# EAGLE design gsm_module (EAGLE 6.5.0)
PARTNAME: gsm_module; REVISION: 3.0
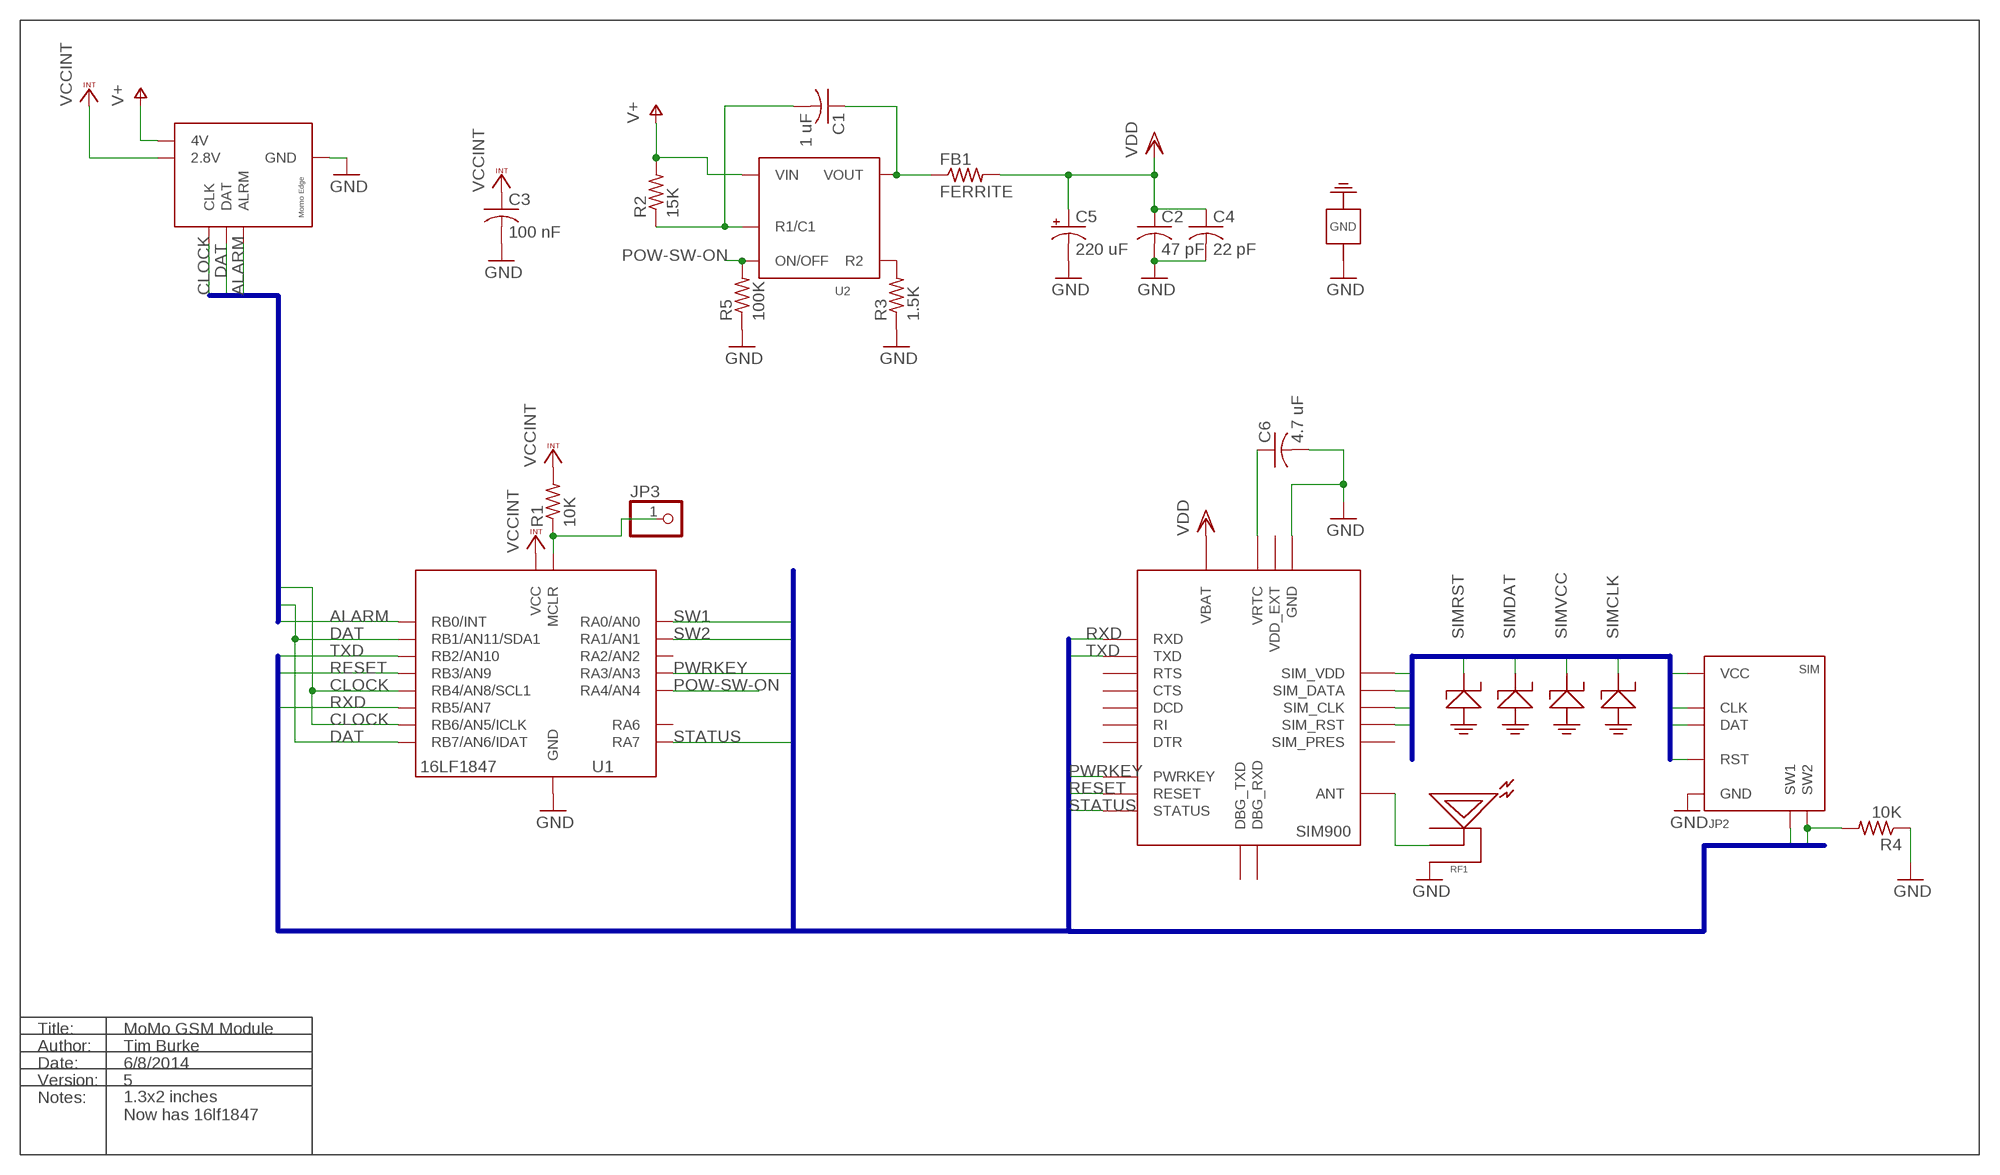
[diagram p0: schematic, sheet 1]

## Parts
C1  1 uF  C-USC0402K  [C0402K]
C2  47 pF  C-USC0402K  [C0402K]
C3  100 nF  C-USC0402  [C0402]
C4  22 pF  C-USC0402K  [C0402K]
C5  220 uF  CPOL-USCT3528  [CT3528]
C6  4.7 uF  C-USC0805  [C0805]
FB1  FERRITE  R-US_R0805  [R0805]
JP1  MOMO-EDGE-6M  [MOMO-EDGE-6M]
JP2  SIMHOLDER-8PINMICROSIM  [MOLEX-MICROSIM-0787270001]
JP3  PINHD-1X1  [1X01]
R1  10K  R-US_R0603  [R0603]
R2  15K  R-US_R0603  [R0603]
R3  1.5K  R-US_R0603  [R0603]
R4  10K  R-US_R0603  [R0603]
R5  100K  R-US_R0603  [R0603]
RF1  RFANTENNA  [RFJACK]
U1  PIC16LF1847  [SSOP20]
U2  TI-HIGHSIDE-PFET  [SOT23-6L]
U3  SIM900  [SIM900]
U4  ESD-SMF05C  [SC70-6L]

## Nets
ALARM: JP1.ALARM(ALRM) U1.7(RB0/INT)
CLOCK: JP1.CLK U1.11(RB4/AN8/SCL1) U1.13(RB6/AN5/ICLK)
DAT: JP1.DAT U1.8(RB1/AN11/SDA1) U1.14(RB7/AN6/IDAT)
GND: C2.2 C3.2 C4.2 C5.- C6.2 JP1.GND JP2.C5(GND) JP2.GND1(GND) JP2.GND2(GND) JP2.GND3(GND) JP2.GND4(GND) JP2.GND5(GND) JP2.GND6(GND) R3.1 R4.1 R5.1 RF1.UNUSED1(SHIELD) RF1.UNUSED2(SHIELD) U1.5(GND) U1.6(GND) U3.17(GND) U3.18(GND) U3.29(GND) U3.39(GND) U3.45(GND) U3.46(GND) U3.53(GND) U3.54(GND) U3.58(GND) U3.59(GND) U3.61(GND) U3.62(GND) U3.63(GND) U3.64(GND) U3.65(GND) U4.2
N$1: R3.2 U2.1(R2)
N$2: JP3.1 R1.1 U1.4(MCLR)
N$3: C1.2 R2.1 U2.6(R1/C1)
N$4: C1.1 FB1.1 U2.2(VOUT) U2.3(VOUT)
N$5: C6.1 U3.26(VRTC)
N$7: RF1.ANTENNA(PIN) U3.60(ANT)
POW-SW-ON: R5.2 U1.3(RA4/AN4) U2.5(ON/OFF)
PWRKEY: U1.2(RA3/AN3) U3.1(PWRKEY)
RESET: U1.10(RB3/AN9) U3.16(RESET)
RXD: U1.12(RB5/AN7) U3.10(RXD)
SIMCLK: JP2.C3(CLK) U3.32(SIM_CLK) U4.3
SIMDAT: JP2.C7(DAT) U3.31(SIM_DATA) U4.5
SIMRST: JP2.C2(RST) U3.33(SIM_RST) U4.1
SIMVCC: JP2.C1(VCC) U3.30(SIM_VDD) U4.4
STATUS: U1.18(RA7) U3.66(STATUS)
SW1: JP2.DCONT(SW1) U1.19(RA0/AN0)
SW2: JP2.DSPRING(SW2) R4.2 U1.20(RA1/AN1)
TXD: U1.9(RB2/AN10) U3.9(TXD)
V+: JP1.4V R2.2 U2.4(VIN)
VCCINT: C3.1 JP1.V28(2.8V) R1.2 U1.15(VCC) U1.16(VCC)
VDD: C2.1 C4.1 C5.+ FB1.2 U3.55(VBAT) U3.56(VBAT) U3.57(VBAT)
Unconnected: U1.1(RA2/AN2) U1.17(RA6) U3.3(DTR) U3.4(RI) U3.5(DCD) U3.7(CTS) U3.8(RTS) U3.27(DBG_TXD) U3.28(DBG_RXD) U3.34(SIM_PRES) U4.6

## Buses
MIB:CLOCK,DAT,PMCLR,ALARM
SIMBUS:SIMVCC,SIMCLK,SIMDAT,SIMRST
SIM900CONN:RXD,TXD,PWRKEY,RESET,STATUS,SW1,SW2

## Notes on the sheet
- Title: | MoMo GSM Module
- Author: | Tim Burke
- Date: | 6/8/2014
- Version: | 5
- Notes:
- 1.3x2 inches
  Now has 16lf1847

## Power pins joined to a net without a drawn wire
VDD_EXT: U3.15(VDD_EXT)

## Library data of the parts
C1 = rcl:C-US: CAPACITOR, American symbol; DIGIKEY-PN: 445-4114-1-ND
C2 = rcl:C-US: CAPACITOR, American symbol; DIGIKEY-PN: 445-1243-1-ND
C3 = rcl:C-US: CAPACITOR, American symbol; DIGIKEY-PN: 445-1265-1-ND
C4 = rcl:C-US: CAPACITOR, American symbol; DIGIKEY-PN: 445-1239-1-ND
C5 = rcl:CPOL-US: POLARIZED CAPACITOR, American symbol
C6 = rcl:C-US: CAPACITOR, American symbol; DIGIKEY-PN: 1276-1259-1-ND
FB1 = rcl:R-US_: RESISTOR, American symbol; DIGIKEY-PN: 445-1567-1-ND
JP1 = components:MOMO-EDGE-6M; DESCRIPTION: 6 pin r/a male header; DIGIKEY-PN: 609-3327-ND; FOOTPRINT: Through Hole
JP2 = components:SIMHOLDER-8PIN; DIGIKEY-PN: WM9260CT-ND
JP3 = pinhead:PINHD-1X1: PIN HEADER
R1 R4 = rcl:R-US_: RESISTOR, American symbol; DIGIKEY-PN: P10.0KHCT-ND
R2 = rcl:R-US_: RESISTOR, American symbol; DIGIKEY-PN: P15KGCT-ND
R3 = rcl:R-US_: RESISTOR, American symbol; DIGIKEY-PN: P1.5KGCT-ND
R5 = rcl:R-US_: RESISTOR, American symbol; DIGIKEY-PN: P100KHCT-ND
RF1 = components:RFANTENNA; DIGIKEY-PN: J983CT-ND
U1 = components:PIC16LF1847; DIGIKEY-PN: PIC16LF1847-I/SS-ND
U2 = components:TI-HIGHSIDE-PFET; DESCRIPTION: TPS27081 Highside Load Controller; DIGIKEY-PN: 296-34970-1-ND
U3 = components:SIM900; DESCRIPTION: SIM900 GSM/GPRS Quadband GSM Modem; FOOTPRINT: Custom SMD; MANU: SIMCOM; MPN: SIM900
U4 = components:ESD-SMF05C; DESCRIPTION: Fast ESD Diode (Quadpack); DIGIKEY-PN: SMF05CCT-ND

## Board
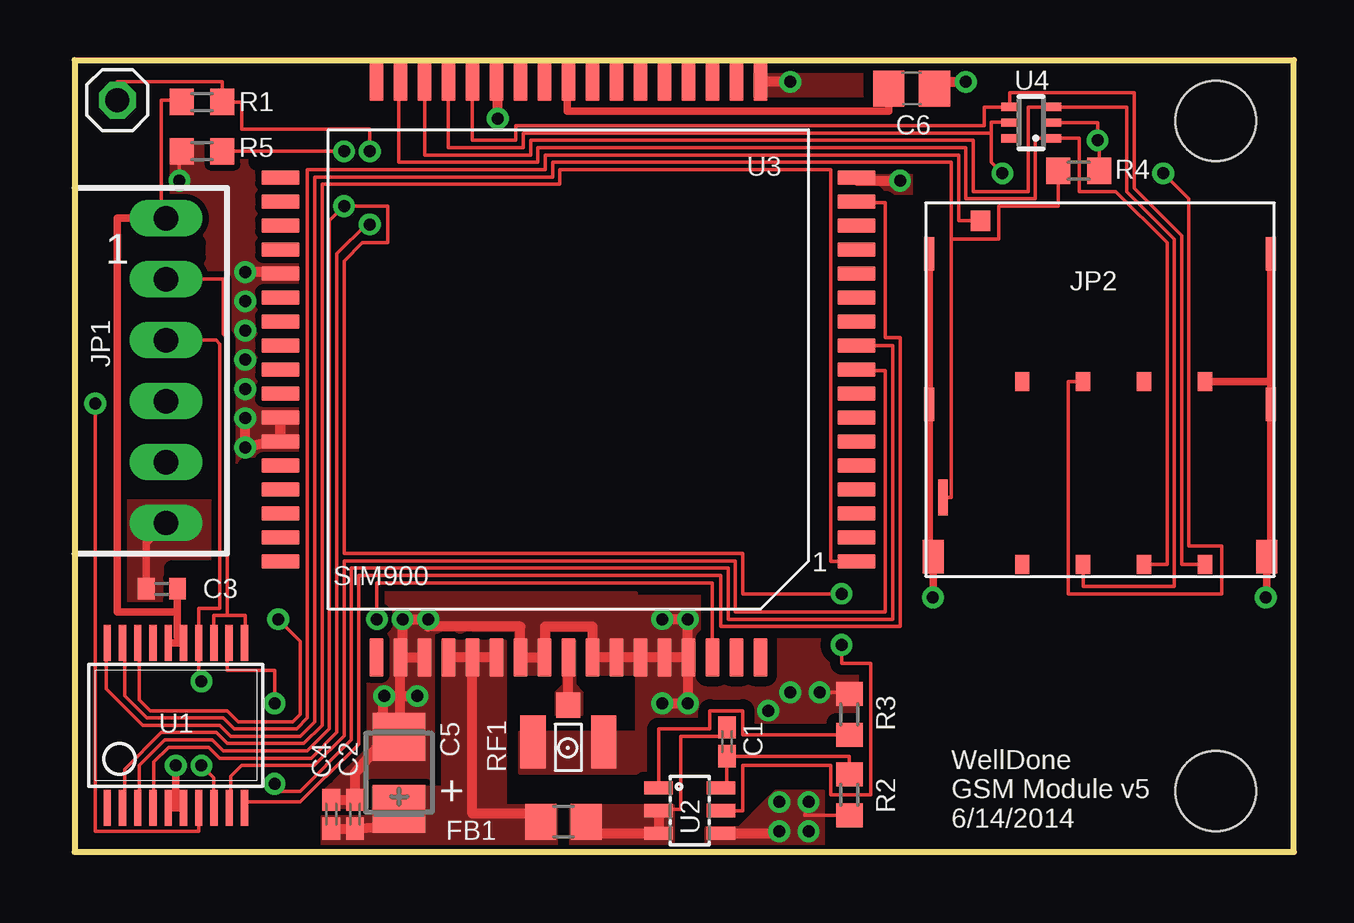
[diagram p1: board, top side]
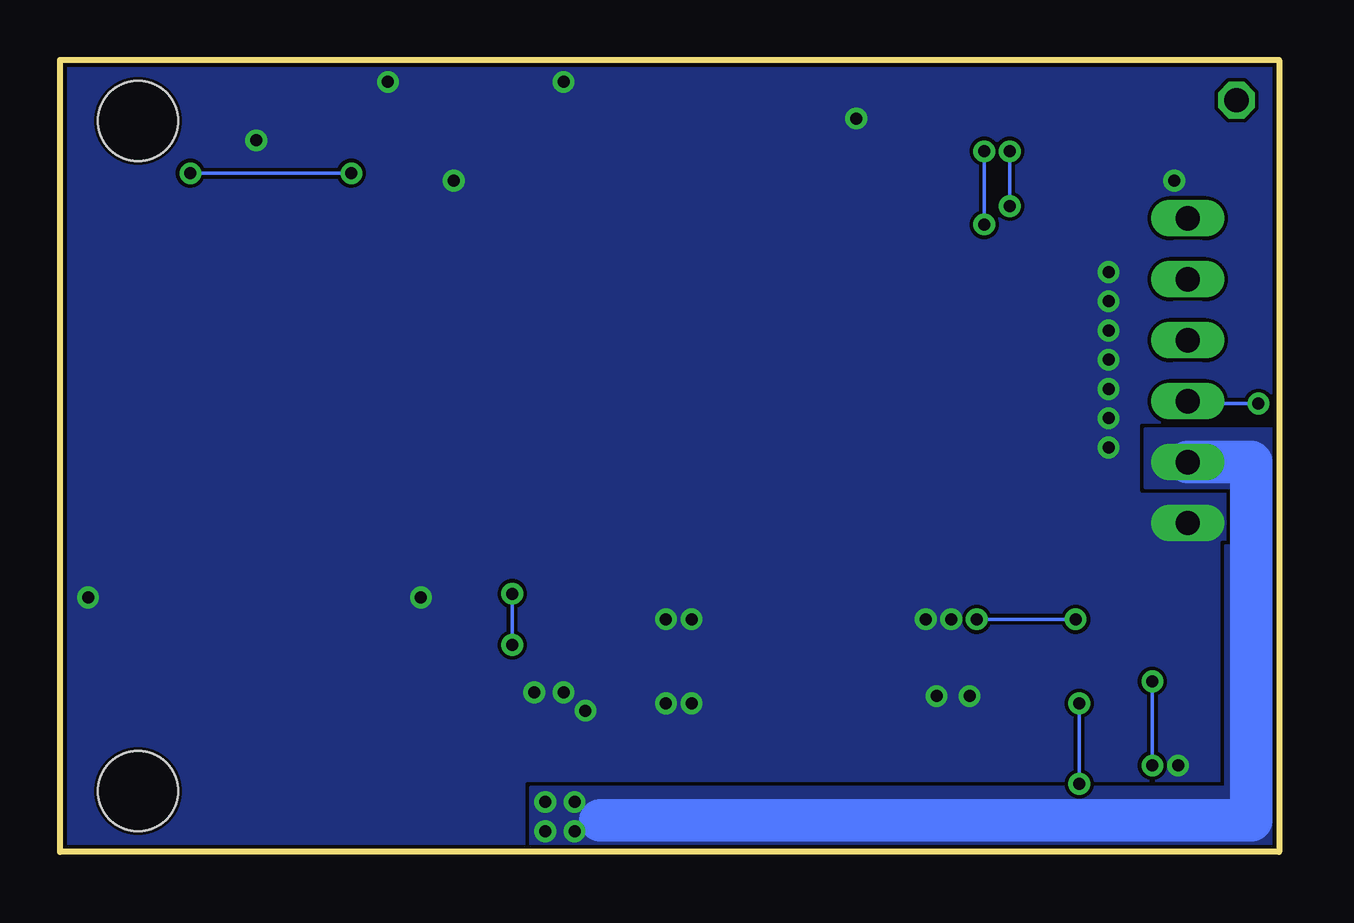
[diagram p2: board, bottom side, seen from below]

Size 50.8 x 33.02 mm. Coordinates in mm from the lower left corner, seen from the top.
Outline: 0,33.02 0,0 50.8,0 50.8,33.02 0,33.02
Copper layers (1*16): Top 0.035mm / dielectric 1.5mm / Bottom 0.035mm
Design rules "default *": minimum track width 6mil, minimum drill 19mil, track to track 6mil, track to pad 6mil, pad to pad 6mil, via to via 6mil, smd to smd 6mil, copper to edge 6mil, drill to drill 8mil, minimum pad ring 10mil, minimum via ring 8mil, stop-mask expansion 4mil, vias tented up to drill 0mil, thermal gap 10mil
Holes 3.35 mm at 47.55,30.48 47.55,2.54
tRestrict: area 47.7,2.1 to 50.4,2.4; area 18.4,30.6 to 18.5,31; area 4.8,22.2 to 5.1,22.8; area 4.8,24.8 to 5.1,25.4; area 7.1,16 to 7.4,16.1; area 10,1.6 to 10.2,2.4; area 34.2,26.8 to 34.8,26.9; area 4.1,30 to 5.4,30.1; area 7.6,28.8 to 7.7,28.9; area 4.5,2.8 to 4.8,3; area 3.6,2.8 to 3.9,3; area 3.6,3.1 to 4.7,4.1; 4 more areas

### Footprints (pad centres in the part's own frame; a part is rotated, then mirrored left to right if it is on the bottom)
C0402K = smd 0.925 x 0.74: 1 -0.6,0; 2 0.6,0
C0402 = smd 0.7 x 0.9: 1 -0.65,0; 2 0.65,0
CT3528 = smd 2 x 2.2: + -1.5,0; - 1.5,0
C0805 = smd 1.3 x 1.5: 1 -0.95,0; 2 0.95,0
R0805 = smd 1.3 x 1.5: 1 -0.95,0; 2 0.95,0
MOMO-EDGE-6M = drill 1.016 long: 4V 0,0; ALARM 0,2.54; CLK 0,7.62; DAT 0,5.08; GND 0,-2.54; V28 0,10.16
MOLEX-MICROSIM-0787270001 = smd 0.8 x 0.6: C1 7.62,4.38; C2 7.62,1.84; C3 7.62,-0.7; C4 7.62,-3.24; C5 0,4.38; C6 0,1.84; C7 0,-0.7; C8 0,-3.24 | smd 0.85 x 0.8: DCONT -6.7,-4.98 | smd 1.5 x 0.4: DSPRING 4.82,-6.54 | smd 1.4 x 0.87: GND1 7.29,6.95; GND6 7.29,-6.95 | smd 1.4 x 0.42: GND2 0.94,7.115; GND3 -5.32,7.115; GND4 -5.32,-7.115; GND5 0.94,-7.115
1X01 = drill 1.016 octagon: 1 0,0
R0603 = smd 1 x 1.1: 1 -0.85,0; 2 0.85,0
RFJACK = smd 1.05 x 1: ANTENNA 2.795,1.488 | smd 2.2 x 1.05: UNUSED1 1.27,2.953; UNUSED2 1.27,0
SSOP20 = smd 0.3 x 1.5: 1 -2.857,-3.431; 2 -2.222,-3.431; 3 -1.587,-3.431; 4 -0.952,-3.431; 5 -0.317,-3.431; 6 0.318,-3.431; 7 0.953,-3.431; 8 1.588,-3.431; 9 2.223,-3.431; 10 2.858,-3.431; 11 2.858,3.431; 12 2.219,3.431; 13 1.588,3.431; 14 0.953,3.431; 15 0.318,3.431; 16 -0.317,3.431; 17 -0.952,3.431; 18 -1.587,3.431; 19 -2.222,3.431; 20 -2.857,3.431
SOT23-6L = smd 0.55 x 1.2: 1 -0.95,-1.3; 2 0,-1.3; 3 0.95,-1.3; 4 0.95,1.3; 5 0,1.3; 6 -0.95,1.3
SIM900 = smd 1.6 x 0.6: 1 -12,8; 2 -12,7; 3 -12,6; 4 -12,5; 5 -12,4; 6 -12,3; 7 -12,2; 8 -12,1; 9 -12,0; 10 -12,-1; 11 -12,-2; 12 -12,-3; 13 -12,-4; 14 -12,-5; 15 -12,-6; 16 -12,-7; 17 -12,-8; 35 12,-8; 36 12,-7; 37 12,-6; 38 12,-5; 39 12,-4; 40 12,-3; 41 12,-2; 42 12,-1; 43 12,0; 44 12,1; 45 12,2; 46 12,3; 47 12,4; 48 12,5; 49 12,6; 50 12,7; 51 12,8 | smd 0.6 x 1.6: 18 -8,-12; 19 -7,-12; 20 -6,-12; 21 -5,-12; 22 -4,-12; 23 -3,-12; 24 -2,-12; 25 -1,-12; 26 0,-12; 27 1,-12; 28 2,-12; 29 3,-12; 30 4,-12; 31 5,-12; 32 6,-12; 33 7,-12; 34 8,-12; 52 8,12; 53 7,12; 54 6,12; 55 5,12; 56 4,12; 57 3,12; 58 2,12; 59 1,12; 60 0,12; 61 -1,12; 62 -2,12; 63 -3,12; 64 -4,12; 65 -5,12; 66 -6,12; 67 -7,12; 68 -8,12
SC70-6L = smd 0.35 x 0.8: 1 -0.65,-0.85; 2 0,-0.85; 3 0.65,-0.85; 4 0.65,0.85; 5 0,0.85; 6 -0.65,0.85

### Placement (x,y rotation side)
C1  27.18,4.6 270 top
C2  11.68,1.57 90 top
C3  3.63,10.97 180 top
C4  10.69,1.57 90 top
C5  13.51,3.3 90 top
C6  34.87,31.83 0 top
FB1  20.37,1.27 180 top
JP1  3.81,16.26 0 top
JP2  42.72,19.61 270 top
JP3  1.78,31.34 0 top
R1  5.31,31.27 180 top
R2  32.28,2.39 270 top
R3  32.28,5.74 270 top
R4  41.83,28.4 180 top
R5  5.31,29.21 0 top
RF1  22.05,3.33 90 top
U1  4.22,5.28 0 top
U2  25.63,1.73 270 top
U3  20.57,20.12 180 top
U4  39.85,30.4 90 top

### Tracks (layer width: path | path; a pad name or v marks a point on that pad's centre or on a via)
ALARM  (via drill 0.5)
  Top 0.152: U1.7 5.17,0.86 0.86,0.86 v0.86,18.69
  Bottom 0.152: v0.86,18.69 3.81,18.69 JP1.ALARM
CLOCK
  Top 0.152: U1.13 5.8,9.86 6.35,9.86 | 6.35,9.86 7.11,9.86 7.11,8.71 U1.11 | JP1.CLK 6.2,23.88 6.2,21.59 6.35,21.44 6.35,9.86
DAT  (via drill 0.5)
  Top 0.152: JP1.DAT 5.89,21.34 6.04,21.18 6.04,10.16 5.17,10.16 U1.14 5.17,7.23 v5.28,7.11 | U1.8 5.8,3.09 v5.28,3.61
  Bottom 0.152: v5.28,7.11 v5.28,3.61
GND  (via drill 0.5)
  Top 0.152: R5.1 4.37,29.21 v4.37,27.99 | v31.04,6.65 32.28,6.65 R3.1 | R4.1 42.68,29.67 v42.62,29.67 42.62,30.4 U4.2
  Top 0.305: U1.5 U1.6 4.22,1.85 v4.22,3.61 | C3.2 2.98,12.89 JP1.GND | JP2.GND4 JP2.GND5 35.61,12.48 JP2.GND6 35.77,10.63 v35.76,10.62 | 49.84,19.61 JP2.GND2 49.84,12.48 JP2.GND1 49.67,10.66 v49.63,10.62 | 49.84,19.61 JP2.GND3 | JP2.C5 49.84,19.61
  Top 0.406: C4.2 C2.2 11.68,3.3 12.75,4.52 v12.9,6.5 | v12.9,6.5 v14.28,6.5 | v12.9,6.5 13.46,6.5 | 13.57,5.47 U3.53 | U3.53 U3.54 | U3.46 U3.45 8.57,17.17 v7.11,16.87 v7.11,18.09 | U3.39 8.57,24.18 v7.11,24.18 | v17.63,30.58 17.63,32.12 U3.29 | v29.82,32.11 v29.82,32.12 U3.18 | U3.17 32.57,27.99 v34.39,27.99 | C6.2 35.82,32.11 v37.14,32.11 | 25.55,8.12 U3.65 25.57,6.2 v25.55,6.2 v24.49,6.2 | 25.55,8.12 v25.55,9.7 v24.49,9.7 | 25.55,8.12 U3.64 U3.63 U3.62 U3.61 21.57,9.4 19.61,9.4 19.61,8.12 U3.59 U3.58 18.57,9.4 14.73,9.4 v14.73,9.7 v13.67,9.7 13.67,8.12 U3.53
  other vias: 7.11,19.3 7.11,20.52 7.11,21.74 7.11,22.96 29.82,6.65 28.91,5.89
  pour Top (no thermals): 14.88,10.16 14.88,3.76 12.29,3.76 12.29,6.65 13.36,6.65 13.36,10.16
  pour Bottom (rank 2, no thermals): -0.05,33.02 -0.05,-0.05 50.85,-0.05 50.85,33.02
  pour Top (isolate 0.254, rank 2, no thermals): -0.05,33.02 -0.05,-0.05 16.71,-0.05 16.71,33.02
  pour Top (isolate 0.406, rank 2, no thermals): 34.85,-0.05 23.42,-0.05 23.42,33.32 34.85,33.32
  pour Top (isolate 0.406, rank 2, no thermals): 18.54,4.98 23.42,4.98 23.42,6.81 23.88,6.81 23.88,3.3 18.54,3.3
  pour Top (no thermals): 18.39,7.42 18.39,9.25 16.56,9.25 16.54,10.82 23.39,10.79 23.42,7.42 21.44,7.42 21.44,9.25 19.76,9.25 19.76,7.42
N$1
  Top 0.152: U2.1 24.33,5.13 26.47,5.13 26.47,5.89 27.84,5.89 27.84,4.89 R3.2
N$2  (via drill 0.5)
  Top 0.152: v12.29,29.21 12.29,30.12 6.96,30.12 6.96,31.27 R1.1 6.16,32.11 1.78,32.11 JP3.1 | v12.29,26.16 12.14,26.16 10.92,24.94 10.92,4.98 9.86,3.91 6.04,3.91 5.59,4.37 3.91,4.37 3.3,3.76 3.3,1.85 U1.4
  Bottom 0.152: v12.29,29.21 v12.29,26.16
N$3
  Top 0.152: R2.1 32.28,4 C1.2 27.18,2.68 U2.6
N$4
  Top 0.152: U2.2 24.33,1.78 25.25,1.78 25.25,4.59 25.25,4.83 26.77,4.83 27.18,4.83 C1.1
  Top 0.406: FB1.1 21.81,0.78 U2.3 U2.2
  pour Top (no thermals): 20.68,1.93 24.94,1.93 24.94,-0.05 20.68,-0.05
N$5
  Top 0.305: C6.1 33.92,30.89 20.52,30.89 20.52,32.12 U3.26
N$7
  Top 0.406: RF1.ANTENNA 20.57,6.14 U3.60
  pour Top (no thermals): 20.37,8.79 20.37,6.96 20.07,6.65 20.07,5.74 21.13,5.74 21.13,6.65 20.83,6.96 20.83,8.79
POW-SW-ON  (via drill 0.5)
  Top 0.152: v11.23,29.21 R5.2 | U2.5 27.84,1.73 27.84,3.61 31.5,3.61 31.5,2.39 33.17,2.39 33.17,7.87 31.95,7.87 v31.95,8.64 | v31.95,10.77 27.84,10.77 27.84,12.45 11.23,12.45 11.23,24.64 11.99,25.4 13.06,25.4 13.06,26.92 v11.23,26.92 10.62,26.31 10.62,5.13 9.7,4.22 6.2,4.22 5.74,4.67 3.76,4.67 2.69,3.61 2.69,1.92 U1.3
  Bottom 0.152: v11.23,26.92 v11.23,29.21 | v31.95,8.64 v31.95,10.77
PWRKEY
  Top 0.152: U3.1 31.5,12.12 31.5,28.45 20.22,28.45 20.22,27.84 10.31,27.84 10.31,5.28 9.55,4.52 6.35,4.52 5.89,4.98 3.61,4.98 2.08,3.45 2.08,1.94 U1.2
RESET
  Top 0.152: U3.16 32.57,27.08 33.78,27.08 33.78,21.44 34.39,21.44 34.39,9.4 26.92,9.4 26.92,11.53 11.84,11.53 11.84,4.5 10.49,3.15 10.46,3.15 9.4,2.08 7.07,2.08 U1.10 | 7.07,1.78 U1.10 | 7.07,1.63 U1.10
RXD  (via drill 0.5)
  Top 0.152: U3.10 34.09,21.12 34.09,9.7 27.23,9.7 27.23,11.84 11.53,11.84 11.53,4.67 9.4,2.54 8.33,2.54 v8.33,2.84 | v8.33,6.2 8.33,7.57 6.35,7.57 6.35,8.71 U1.12
  Bottom 0.152: v8.33,2.84 v8.33,6.2
SIMCLK
  Top 0.152: U3.32 14.58,29.06 19,29.06 19,29.67 37.44,29.67 37.44,27.53 39.73,27.53 39.73,31.05 U4.3 43.84,31.05 43.84,27.53 45.82,25.55 45.82,11.07 42.02,11.07 JP2.C3
SIMDAT  (via drill 0.5)
  Top 0.152: U3.31 15.57,29.36 18.69,29.36 18.69,29.97 38.2,29.97 | 38.2,29.97 38.2,30.43 39,30.43 U4.5 | JP2.C7 41.4,19.61 41.4,10.77 47.8,10.77 47.8,12.75 46.43,12.75 46.43,27.23 v45.36,28.3 | v38.66,28.3 38.2,28.75 38.2,29.97
  Bottom 0.152: v45.36,28.3 v38.66,28.3
SIMRST
  Top 0.152: U3.33 13.51,32.12 13.51,28.75 19.3,28.75 19.3,29.36 37.14,29.36 37.14,27.23 40.03,27.23 40.03,29.75 U4.1 41.86,29.75 41.86,27.53 43.38,27.53 45.52,25.4 45.52,11.99 JP2.C2
SIMVCC
  Top 0.152: U3.30 16.57,29.67 18.39,29.67 18.39,30.28 37.9,30.28 37.9,31.05 U4.4 38.96,31.05 38.96,31.65 44.15,31.65 44.15,27.69 46.13,25.7 46.13,11.99 JP2.C1
STATUS  (via drill 0.5)
  Top 0.152: U3.66 26.57,11.23 12.6,11.23 v12.6,9.7 | v8.48,9.7 9.4,8.79 9.4,5.74 9.09,5.44 6.81,5.44 6.35,5.89 3.15,5.89 2.69,6.35 2.69,8.65 U1.18
  Bottom 0.152: v8.48,9.7 v12.6,9.7
SW1
  Top 0.152: U1.19 2.08,8.63 2.08,6.5 3,5.59 6.2,5.59 6.65,5.13 9.25,5.13 9.7,5.59 9.7,28.45 19.61,28.45 19.61,29.06 36.83,29.06 36.83,26.31 JP2.DCONT
SW2
  Top 0.152: U1.20 1.32,8.68 1.32,6.81 2.84,5.28 6.04,5.28 6.5,4.83 9.4,4.83 10.01,5.44 10.01,28.14 19.91,28.14 19.91,28.75 36.52,28.75 36.52,25.55 | 36.52,25.55 36.52,14.79 JP2.DSPRING | 36.52,25.55 38.51,25.55 38.51,26.92 40.98,26.92 R4.2 arc90 40.83,28.55
TXD
  Top 0.152: U3.9 32.57,20.07 33.78,20.07 33.78,10.01 27.53,10.01 27.53,12.14 11.23,12.14 11.23,4.85 9.98,3.61 6.96,3.61 6.5,3.15 6.5,1.85 U1.9
V+  (via drill 0.5)
  Top 0.152: R2.2 30.43,1.54 v30.58,2.08
  Top 0.406: U2.4 29.21,0.78 v29.36,0.86
  Bottom 1.778: JP1.4V 1.17,16.26 1.17,1.32 28.3,1.32
  other vias: 30.58,0.86 29.36,2.08
  pour Bottom (no thermals): 4.06,15.19 5.59,15.19 5.59,17.63 -0.05,17.63 -0.05,-0.05 31.19,-0.05 31.19,2.69 2.24,2.69 2.24,12.75 1.93,12.75 1.93,15.19
  pour Top (no thermals): 26.31,1.02 27.69,1.02 28.75,2.08 29.21,2.54 31.19,2.54 31.19,0.25 26.31,0.25
VCCINT
  Top 0.152: R1.2 4.46,31.34 3.61,31.34 3.61,26.42 JP1.V28
  Top 0.305: 3.61,26.42 1.78,26.42 1.78,10.01 4.28,10.01 | U1.16 U1.15 4.28,8.97 4.28,10.01 | C3.1 4.28,10.31 4.28,10.01
VDD
  Top 0.406: U3.56 16.57,1.6 19.42,1.6 FB1.2 | C4.1 C2.1 13.61,1.13 | U3.56 U3.55 | U3.57 U3.56
  pour Top (no thermals): 20.07,1.93 17.93,1.93 17.93,8.79 15.34,8.79 15.34,2.69 12.45,2.69 12.45,1.47 10.31,1.47 10.31,-0.05 20.07,-0.05

### Text on the board
tPlace: + | WellDone / GSM Module v5 / 6/14/2014